# EAGLE design teclado_at_f343_smd_v2 (EAGLE 7.2.0)
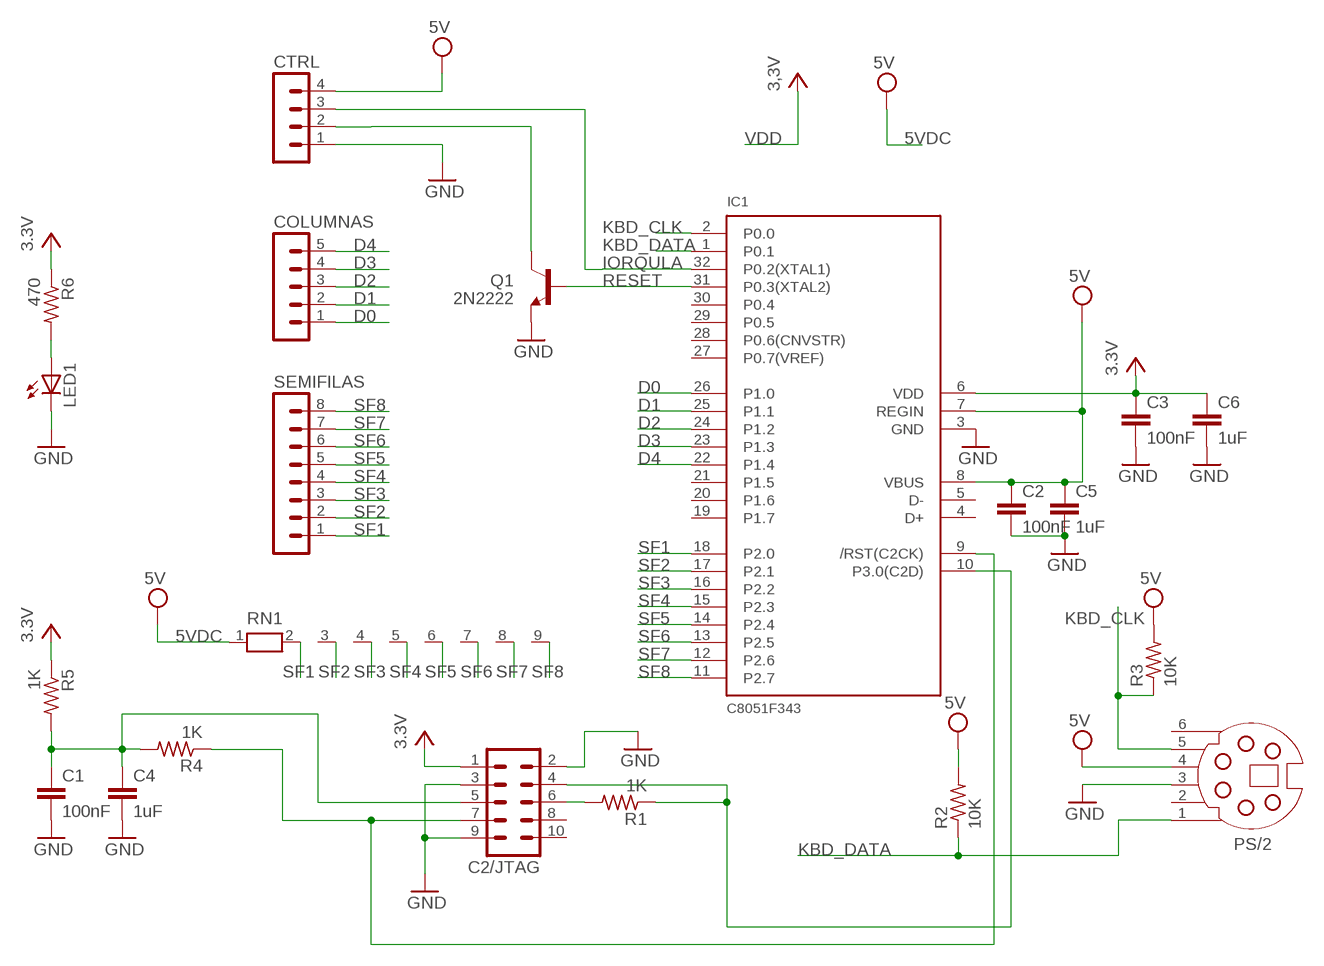
[diagram p0: schematic, sheet 1]

## Parts
C1  100nF  C-EUC0805K  [C0805K]
C2  100nF  C-EUC0805K  [C0805K]
C2/JTAG  MA05-2  [MA05-2]
C3  100nF  C-EUC0805K  [C0805K]
C4  1uF  C-EUC0805K  [C0805K]
C5  1uF  C-EUC0805K  [C0805K]
C6  1uF  C-EUC0805K  [C0805K]
COLUMNAS  MA05-1  [MA05-1]
CTRL  MA04-1  [MA04-1]
IC1  C8051F343  [TQFP32-08]
LED1  LEDCHIP-LED0805  [CHIP-LED0805]
PS/2  SSV-G06  [SSV-BC06]
Q1  2N2222  TRANSISTOR_NPNSOT23-3  [SOT23-3]
R1  1K  R-US_M0805  [M0805]
R2  10K  R-US_M0805  [M0805]
R3  10K  R-US_M0805  [M0805]
R4  1K  R-US_M0805  [M0805]
R5  1K  R-US_M0805  [M0805]
R6  470  R-US_M0805  [M0805]
RN1  RN08  [RN-9]
SEMIFILAS  MA08-1  [MA08-1]

## Nets
5VDC [power]: C2.1 C5.1 CTRL.4 IC1.7(REGIN) IC1.8(VBUS) PS/2.4 R2.2 R3.2 RN1.1 ; supply symbol labelled 5V
D0: COLUMNAS.1 IC1.26(P1.0)
D1: COLUMNAS.2 IC1.25(P1.1)
D2: COLUMNAS.3 IC1.24(P1.2)
D3: COLUMNAS.4 IC1.23(P1.3)
D4: COLUMNAS.5 IC1.22(P1.4)
GND [power]: C1.2 C2.2 C2/JTAG.2 C2/JTAG.3 C2/JTAG.9 C3.2 C4.2 C5.2 C6.2 CTRL.1 IC1.3(GND) LED1.C PS/2.3 Q1.2(E)
IORQULA: CTRL.3 IC1.32(P0.2(XTAL1))
KBD_CLK: IC1.2(P0.0) PS/2.5 R3.1
KBD_DATA: IC1.1(P0.1) PS/2.1 R2.1
N$1: C2/JTAG.7 IC1.9(/RST(C2CK)) R4.1
N$2: LED1.A R6.2
N$3: C1.1 C2/JTAG.5 C4.1 R4.2 R5.2
N$4: C2/JTAG.4 IC1.10(P3.0(C2D)) R1.1
N$5: C2/JTAG.6 R1.2
N$7: CTRL.2 Q1.3(C)
RESET: IC1.31(P0.3(XTAL2)) Q1.1(B)
SF1: IC1.18(P2.0) RN1.2 SEMIFILAS.1
SF2: IC1.17(P2.1) RN1.3 SEMIFILAS.2
SF3: IC1.16(P2.2) RN1.4 SEMIFILAS.3
SF4: IC1.15(P2.3) RN1.5 SEMIFILAS.4
SF5: IC1.14(P2.4) RN1.6 SEMIFILAS.5
SF6: IC1.13(P2.5) RN1.7 SEMIFILAS.6
SF7: IC1.12(P2.6) RN1.8 SEMIFILAS.7
SF8: IC1.11(P2.7) RN1.9 SEMIFILAS.8
VDD [power]: C2/JTAG.1 C3.1 C6.1 IC1.6(VDD) R5.1 R6.1 ; supply symbol labelled 3,3V, 3.3V
Unconnected: C2/JTAG.8 C2/JTAG.10 IC1.4(D+) IC1.5(D-) IC1.19(P1.7) IC1.20(P1.6) IC1.21(P1.5) IC1.27(P0.7(VREF)) IC1.28(P0.6(CNVSTR)) IC1.29(P0.5) IC1.30(P0.4) PS/2.2 PS/2.6

## Library data of the parts
C1-C6 = rcl:C-EU: CAPACITOR, European symbol
C2/JTAG = con-lstb:MA05-2: PIN HEADER
COLUMNAS = con-lstb:MA05-1: PIN HEADER
CTRL = con-lstb:MA04-1: PIN HEADER
IC1 = silabs-2:C8051F343: Full Speed USB Flash MCU
LED1 = adafruit:LED: LED OSRAM: - CHIPLED LG R971, LG N971, LY N971, LG Q971, LY Q971, LO R971, LY R971 LH N974, LH R974 LS Q976, LO Q976, LY Q976 LO Q996 - Hyper CHIPLED LW Q18S LB Q993, LB Q99A, LB R99A - SideLED LS A670, LO A670, LY A670, LG A670, LP A670 LB A673, LV A673, LT A673, LW A673 LH A674 LY A675 LS A676, LA A676, LO A676, LY A676, LW A676 LS A679, LY A679, LG A679 - Hyper Micro SIDELED® LS Y876, LA Y876, LO Y876, LY Y876 LT Y87S - SmartLED LW L88C, LW L88S LB L89C, LB L89S, LG L890 LS L89K, LO L89K, LY L89K LS L896, LA L896, LO L896, LY L896 - TOPLED LS T670, LO T670, LY T670, LG T670, LP T670 LSG T670, LSP T670, LSY T670, LOP T670, LYG T670 LG T671, LOG T671, LSG T671 LB T673, LV T673, LT T673, LW T673 LH T674 LS T676, LA T676, LO T676, LY T676, LB T676, LH T676, LSB T676, LW T676 LB T67C, LV T67C, LT T67C, LS T67K, LO T67K, LY T67K, LW E67C LS E67B, LA E67B, LO E67B, LY E67B, LB E67C, LV E67C, LT E67C LW T67C LS T679, LY T679, LG T679 LS T770, LO T770, LY T770, LG T770, LP T770 LB T773, LV T773, LT T773, LW T773 LH T774 LS E675, LA E675, LY E675, LS T675 LS T776, LA T776, LO T776, LY T776, LB T776 LHGB T686 LT T68C, LB T68C - Hyper Mini TOPLED® LB M676 - Mini TOPLED Santana® LG M470 LS M47K, LO M47K, LY M47K Source: http://www.osram.convergy.de/
PS/2 = con-yamaichi:SSV-G06: YAMAICHI CONNECTOR
Q1 = SparkFun:TRANSISTOR_NPN: Transistor NPN BJT configuration in SOT23 package. MMBT2222 is the common NPN we use. Double check BCE configuration again layout.
R1-R6 = rcl:R-US_: RESISTOR, American symbol
RN1 = resistor-net:RN08: RESISTOR NETWORK
SEMIFILAS = con-lstb:MA08-1: PIN HEADER

## Net classes
0 default: width 0.254 mm, clearance 0.254 mm
1 power: width 0.508 mm, clearance 0.254 mm to class 0, clearance 0.254 mm

## Board
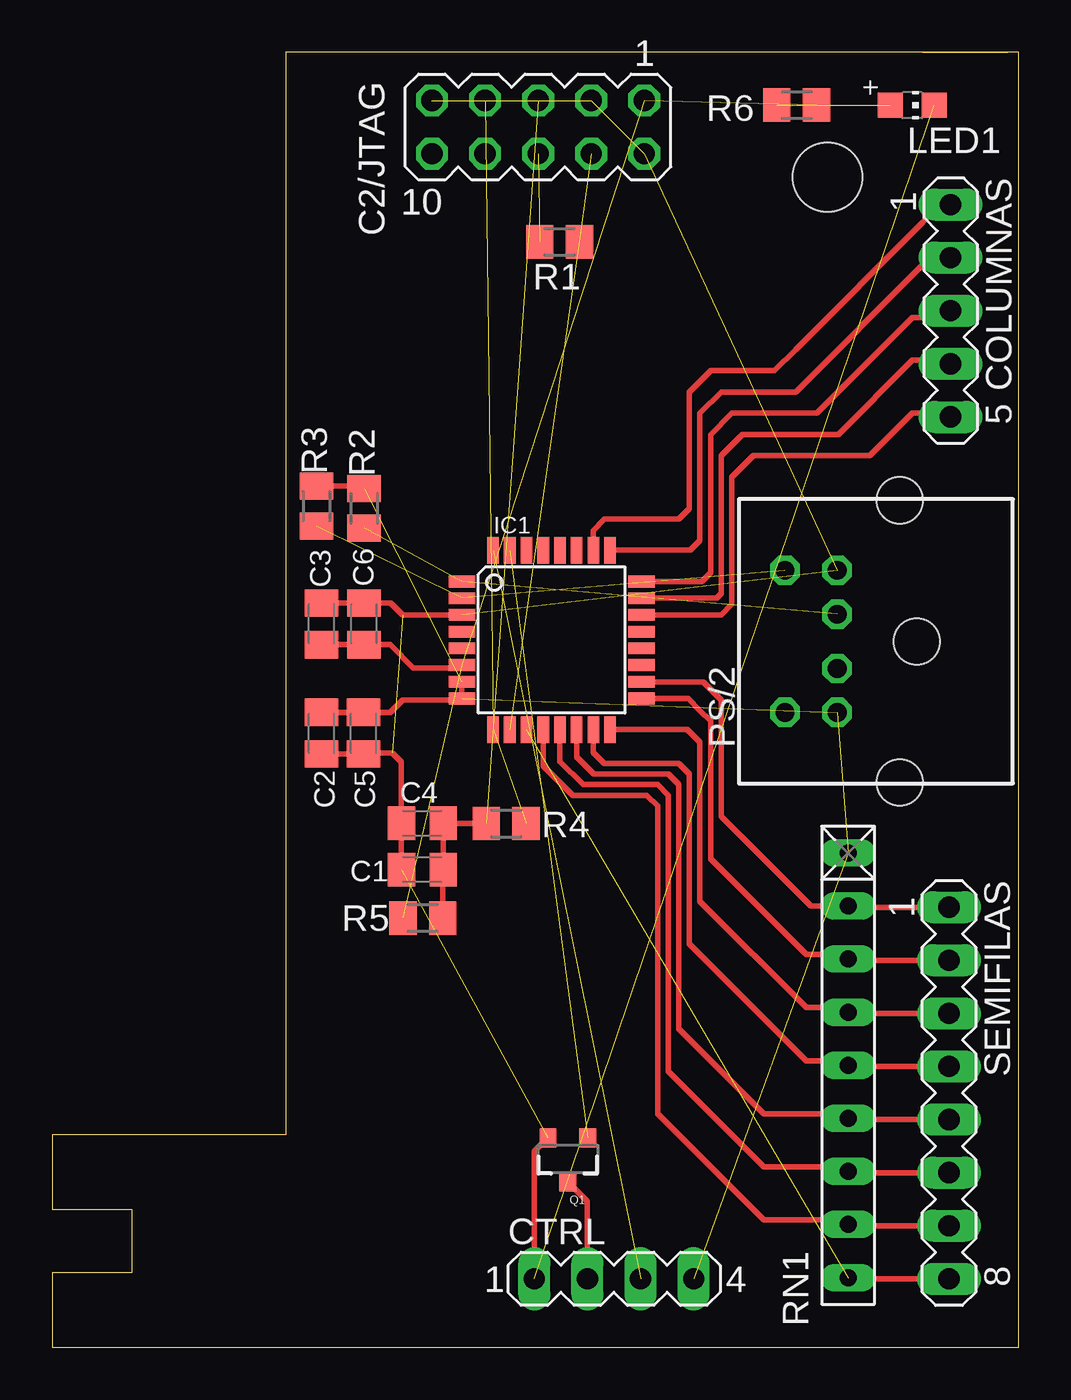
[diagram p1: board, top side]

Size 46.23 x 61.98 mm. Coordinates in mm from the lower left corner, seen from the top.
Outline: 41.66,61.98 45.72,61.98
Outline: 45.72,61.98 11.18,61.98 11.18,10.16 0,10.16 0,6.6 3.81,6.6 3.81,6.58 3.81,3.56 0,3.56 0,2.03 0,0 46.23,0 46.23,5.59 46.23,61.98 45.72,61.98
Copper layers (1*16): Top 0.035mm / dielectric 1.5mm / Bottom 0.035mm
Design rules "ITEADstudio_DRC": minimum track width 6mil, minimum drill 12mil, track to track 6mil, track to pad 6mil, pad to pad 6mil, via to via 6mil, smd to smd 0mil, copper to edge 10mil, drill to drill 10mil, minimum pad ring 10mil, minimum via ring 6mil, stop-mask expansion 2mil, vias tented up to drill 100mil, thermal gap 10mil
Holes 3.3 mm at 37.09,55.99

### Footprints (pad centres in the part's own frame; a part is rotated, then mirrored left to right if it is on the bottom)
C0805K = smd 1.3 x 1.6: 1 -1,0; 2 1,0
MA05-2 = drill 1.016 octagon: 1 -5.08,-1.27; 2 -5.08,1.27; 3 -2.54,-1.27; 4 -2.54,1.27; 5 0,-1.27; 6 0,1.27; 7 2.54,-1.27; 8 2.54,1.27; 9 5.08,-1.27; 10 5.08,1.27
MA05-1 = drill 1.016 long: 1 -5.08,0; 2 -2.54,0; 3 0,0; 4 2.54,0; 5 5.08,0
MA04-1 = drill 1.016 long: 1 -3.81,0; 2 -1.27,0; 3 1.27,0; 4 3.81,0
TQFP32-08 = smd 1.27 x 0.559: 1 -4.293,2.8; 2 -4.293,2; 3 -4.293,1.2; 4 -4.293,0.4; 5 -4.293,-0.4; 6 -4.293,-1.2; 7 -4.293,-2; 8 -4.293,-2.8; 17 4.293,-2.8; 18 4.293,-2; 19 4.293,-1.2; 20 4.293,-0.4; 21 4.293,0.4; 22 4.293,1.2; 23 4.293,2; 24 4.293,2.8 | smd 0.559 x 1.27: 9 -2.8,-4.293; 10 -2,-4.293; 11 -1.2,-4.293; 12 -0.4,-4.293; 13 0.4,-4.293; 14 1.2,-4.293; 15 2,-4.293; 16 2.8,-4.293; 25 2.8,4.293; 26 2,4.293; 27 1.2,4.293; 28 0.4,4.293; 29 -0.4,4.293; 30 -1.2,4.293; 31 -2,4.293; 32 -2.8,4.293
CHIP-LED0805 = smd 1.2 x 1.2: A 0,-1.05; C 0,1.05
SSV-BC06 = drill 0.9 octagon: 1 1.3,8.5; 2 -1.3,8.5; 3 3.4,8.5; 4 -3.4,8.5; 5 3.4,11; 6 -3.4,11 | hole 2.2: -6.75,5.5; 0,4.7; 6.75,5.5
SOT23-3 = smd 0.8 x 0.9: 1 -0.95,-1; 2 0.95,-1; 3 0,1.1
M0805 = smd 1.3 x 1.6: 1 -0.95,0; 2 0.95,0
RN-9 = drill 0.813 long: 1 -10.16,0; 2 -7.62,0; 3 -5.08,0; 4 -2.54,0; 5 0,0; 6 2.54,0; 7 5.08,0; 8 7.62,0; 9 10.16,0
MA08-1 = drill 1.016 long: 1 -8.89,0; 2 -6.35,0; 3 -3.81,0; 4 -1.27,0; 5 1.27,0; 6 3.81,0; 7 6.35,0; 8 8.89,0

### Placement (x,y rotation side)
C1  17.7,22.86 180 top
C2  12.88,29.39 270 top
C2/JTAG  23.24,58.39 180 top
C3  12.88,34.62 90 top
C4  17.7,25.07 180 top
C5  14.88,29.39 270 top
C6  14.91,34.62 90 top
COLUMNAS  42.98,49.61 270 top
CTRL  26.87,3.28 0 top
IC1  23.89,33.85 0 top
LED1  41.15,59.44 270 top
PS/2  46.05,33.78 90 top
Q1  24.66,9.02 180 top
R1  24.27,52.91 180 top
R2  14.92,40.15 90 top
R3  12.64,40.26 90 top
R4  21.71,25.07 180 top
R5  17.73,20.54 0 top
R6  35.61,59.45 180 top
RN1  38.08,13.49 270 top
SEMIFILAS  42.9,12.17 270 top

### Tracks (layer width: path | path; a pad name or v marks a point on that pad's centre or on a via)
5VDC  (4 unrouted)
  Top 0.254: R3.2 14.81,41.21 R2.2 | C2.1 C5.1 16.16,30.39 16.76,30.99 19.53,30.99 IC1.8 IC1.7
D0
  Top 0.254: IC1.26 25.89,39.09 26.42,39.62 29.97,39.62 30.48,40.13 30.48,45.72 31.5,46.74 34.54,46.74 35.56,47.75 41.66,53.85 42.16,54.36 42.65,54.36 COLUMNAS.1
D1
  Top 0.254: IC1.25 30.52,38.14 30.99,38.61 30.99,44.7 32,45.72 35.56,45.72 41.66,51.82 42.65,51.82 COLUMNAS.2
D2
  Top 0.254: IC1.24 31.06,36.65 31.5,37.08 31.5,43.69 32.51,44.7 36.58,44.7 41.15,49.28 42.65,49.28 COLUMNAS.3
D3
  Top 0.254: IC1.23 31.78,35.85 32,36.07 32,42.67 33.02,43.69 37.59,43.69 41.15,47.24 42.8,47.24 COLUMNAS.4
D4
  Top 0.254: IC1.22 32,35.05 32.51,35.56 32.51,41.66 33.53,42.67 39.12,42.67 41.15,44.7 42.8,44.7 COLUMNAS.5
GND  (7 unrouted)
  Top 0.254: C3.2 C6.2 16.2,35.62 16.76,35.05 IC1.3 | C2.2 C5.2 14.94,28.45 16.26,28.45 16.7,28 C4.2 C1.2 | CTRL.1 23.06,9.37 Q1.2
IORQULA  (1 unrouted)
KBD_CLK  (2 unrouted)
KBD_DATA  (2 unrouted)
N$1  (2 unrouted)
N$2  (1 unrouted)
N$3  (1 unrouted)
  Top 0.254: R4.2 C4.1 C1.1 18.68,22.83 R5.2
N$4  (2 unrouted)
N$5  (1 unrouted)
N$7
  Top 0.254: CTRL.2 25.6,6.98 Q1.3
RESET  (1 unrouted)
SF1
  Top 0.254: SEMIFILAS.1 38.13,21.06 RN1.2 36.29,21.11 32,25.4 32,30.48 32,30.99 31.14,31.85 IC1.18
SF2
  Top 0.254: SEMIFILAS.2 38.13,18.52 RN1.3 37.85,18.8 36.07,18.8 31.5,23.37 31.5,29.97 30.99,30.48 30.42,31.05 IC1.17
SF3
  Top 0.254: SEMIFILAS.3 38.13,15.98 RN1.4 37.85,16.26 36.07,16.26 30.99,21.34 30.99,28.96 30.39,29.55 IC1.16
SF4
  Top 0.254: SEMIFILAS.4 38.13,13.44 RN1.5 37.85,13.72 36.07,13.72 30.48,19.3 30.48,27.43 29.97,27.94 26.42,27.94 25.89,28.47 IC1.15
SF5
  Top 0.254: SEMIFILAS.5 38.13,10.9 RN1.6 37.85,11.18 34.04,11.18 29.97,15.24 29.97,26.92 29.46,27.43 25.91,27.43 25.09,28.25 IC1.14
SF6
  Top 0.254: SEMIFILAS.6 38.13,8.36 RN1.7 37.85,8.64 34.04,8.64 29.46,13.21 29.46,26.42 28.96,26.92 25.4,26.92 24.29,28.04 IC1.13
SF7
  Top 0.254: SEMIFILAS.7 38.13,5.82 RN1.8 37.85,6.1 34.04,6.1 28.96,11.18 28.96,25.91 28.45,26.42 24.89,26.42 23.49,27.82 IC1.12
SF8  (1 unrouted)
  Top 0.254: SEMIFILAS.8 38.13,3.28 RN1.9
VDD  (3 unrouted)
  Top 0.254: C3.1 C6.1 16.16,33.62 17.27,32.51 19.46,32.51 IC1.6